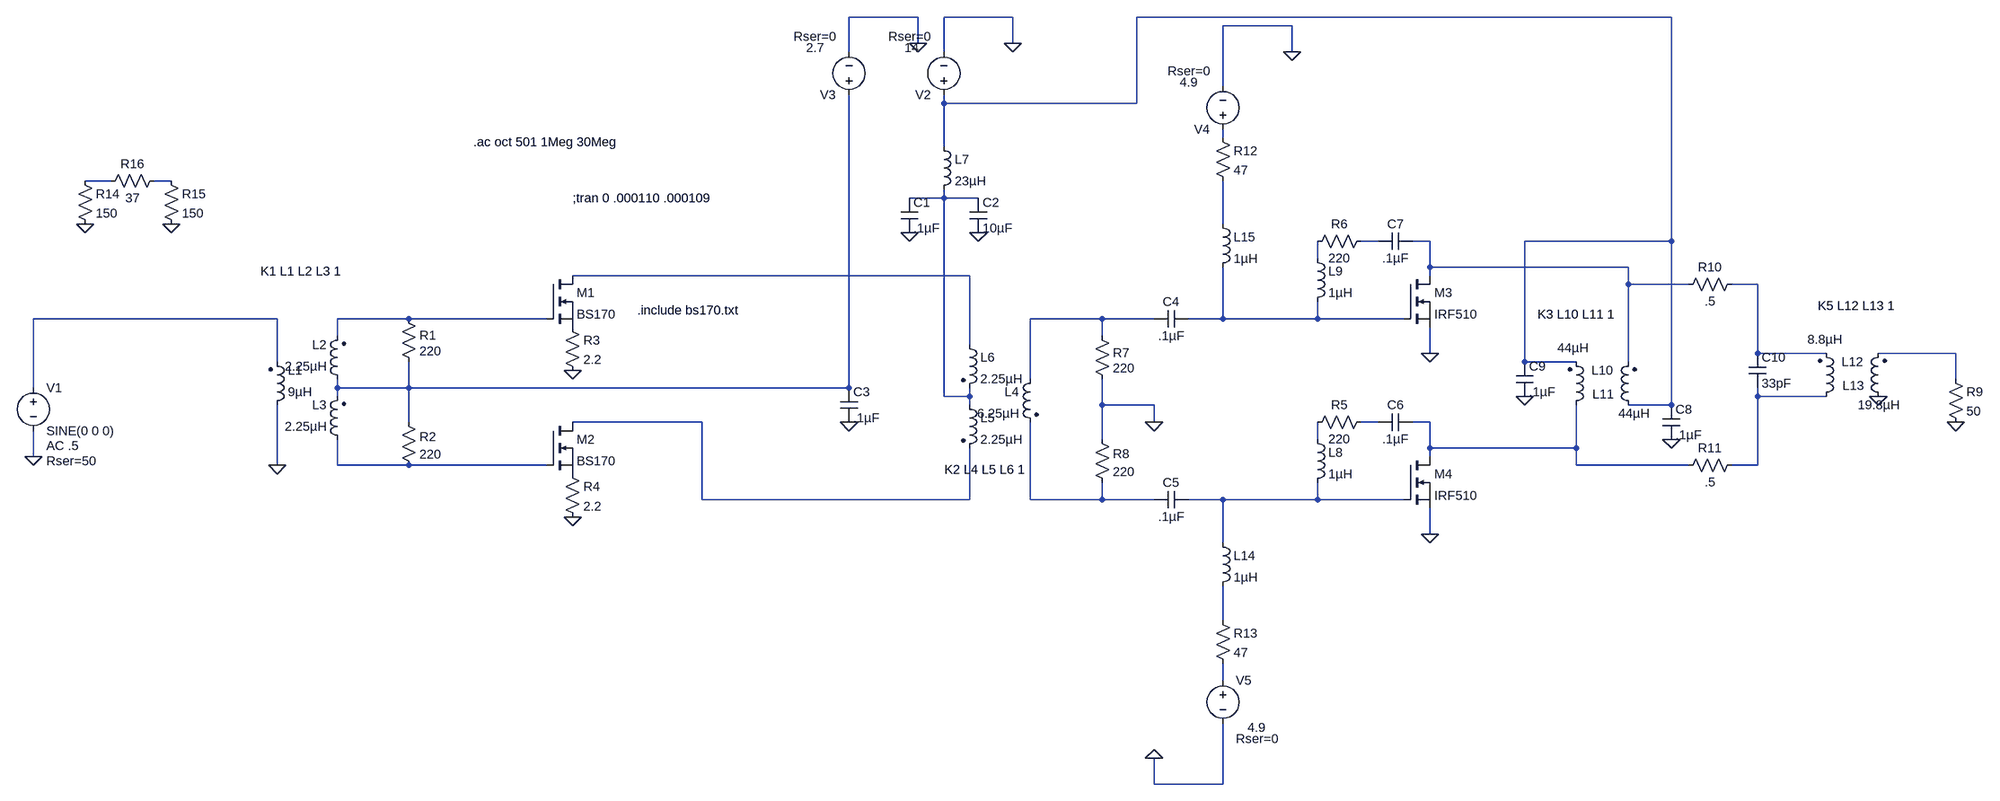
[diagram p0: schematic bs170 push pull.asc]
bs170 push pull.asc, the LTspice schematic file:
Version 4
SHEET 1 2728 900
WIRE 736 -528 608 -528
WIRE 912 -528 784 -528
WIRE 2144 -528 1152 -528
WIRE 1440 -512 1312 -512
WIRE 736 -480 736 -528
WIRE 912 -480 912 -528
WIRE 608 -464 608 -528
WIRE 784 -464 784 -528
WIRE 1440 -464 1440 -512
WIRE 1312 -400 1312 -512
WIRE 784 -368 784 -384
WIRE 1152 -368 1152 -528
WIRE 1152 -368 784 -368
WIRE 1312 -304 1312 -320
WIRE 784 -288 784 -368
WIRE -1040 -224 -1088 -224
WIRE -928 -224 -960 -224
WIRE 784 -192 784 -208
WIRE 784 -192 720 -192
WIRE 848 -192 784 -192
WIRE 1312 -144 1312 -224
WIRE 1600 -112 1568 -112
WIRE 1696 -112 1664 -112
WIRE 2144 -112 2144 -528
WIRE 2144 -112 1872 -112
WIRE 1488 -80 1488 -112
WIRE 1696 -64 1696 -112
WIRE 2064 -64 1696 -64
WIRE 832 -48 80 -48
WIRE 1696 -48 1696 -64
WIRE 2064 -32 2064 -64
WIRE 2176 -32 2064 -32
WIRE 2304 -32 2256 -32
WIRE -480 32 -1184 32
WIRE -224 32 -368 32
WIRE 32 32 -224 32
WIRE 1088 32 944 32
WIRE 1184 32 1088 32
WIRE 1312 32 1312 -64
WIRE 1312 32 1248 32
WIRE 1488 32 1488 0
WIRE 1488 32 1312 32
WIRE 1648 32 1488 32
WIRE -368 64 -368 32
WIRE 1088 64 1088 32
WIRE 832 80 832 -48
WIRE 1696 96 1696 48
WIRE 2304 96 2304 -32
WIRE 2432 96 2304 96
WIRE 2672 96 2528 96
WIRE -480 112 -480 32
WIRE 1872 112 1872 -112
WIRE 1968 112 1872 112
WIRE 2064 112 2064 -32
WIRE 944 144 944 32
WIRE 2672 144 2672 96
WIRE -1184 160 -1184 32
WIRE -368 160 -368 144
WIRE -224 160 -224 112
WIRE -224 160 -368 160
WIRE 608 160 608 -384
WIRE 608 160 -224 160
WIRE -368 176 -368 160
WIRE 784 176 784 -192
WIRE 832 176 832 160
WIRE 832 176 784 176
WIRE 2304 176 2304 160
WIRE 2432 176 2304 176
WIRE 832 192 832 176
WIRE 1088 192 1088 144
WIRE 1184 192 1088 192
WIRE 2144 192 2144 -112
WIRE 2144 192 2064 192
WIRE -224 224 -224 160
WIRE 320 224 80 224
WIRE 1184 224 1184 192
WIRE 1600 224 1568 224
WIRE 1696 224 1664 224
WIRE 1088 256 1088 192
WIRE 1488 256 1488 224
WIRE 1696 272 1696 224
WIRE 1968 272 1968 192
WIRE 1968 272 1696 272
WIRE -1184 288 -1184 240
WIRE 1696 288 1696 272
WIRE -480 304 -480 192
WIRE -368 304 -368 256
WIRE -224 304 -368 304
WIRE 32 304 -224 304
WIRE 1968 304 1968 272
WIRE 2176 304 1968 304
WIRE 2304 304 2304 176
WIRE 2304 304 2256 304
WIRE 320 368 320 224
WIRE 832 368 832 272
WIRE 832 368 320 368
WIRE 944 368 944 224
WIRE 1088 368 1088 336
WIRE 1088 368 944 368
WIRE 1184 368 1088 368
WIRE 1312 368 1248 368
WIRE 1488 368 1488 336
WIRE 1488 368 1312 368
WIRE 1648 368 1488 368
WIRE 1696 432 1696 384
WIRE 1312 448 1312 368
WIRE 1312 592 1312 528
WIRE 1312 704 1312 672
WIRE 1184 896 1184 848
WIRE 1312 896 1312 784
WIRE 1312 896 1184 896
FLAG 80 128 0
FLAG 80 400 0
FLAG -480 304 0
FLAG -1184 288 0
FLAG 1184 224 0
FLAG 912 -480 0
FLAG 736 -480 0
FLAG 720 -128 0
FLAG 848 -128 0
FLAG 608 224 0
FLAG 1440 -464 0
FLAG 2144 256 0
FLAG 1872 176 0
FLAG 2528 176 0
FLAG 2672 224 0
FLAG 1184 848 0
FLAG 1696 96 0
FLAG 1696 432 0
FLAG -1088 -144 0
FLAG -928 -144 0
SYMBOL ind2 -496 208 M180
WINDOW 0 36 80 Left 2
WINDOW 3 36 40 Left 2
SYMATTR InstName L1
SYMATTR Value 9µH
SYMATTR Type ind
SYMBOL ind2 -352 160 R180
WINDOW 0 36 80 Left 2
WINDOW 3 36 40 Left 2
SYMATTR InstName L2
SYMATTR Value 2.25µH
SYMATTR Type ind
SYMBOL ind2 -352 272 R180
WINDOW 0 36 80 Left 2
WINDOW 3 36 40 Left 2
SYMATTR InstName L3
SYMATTR Value 2.25µH
SYMATTR Type ind
SYMBOL res -240 16 R0
WINDOW 0 36 47 Left 2
SYMATTR InstName R1
SYMATTR Value 220
SYMBOL res -240 208 R0
WINDOW 0 36 43 Left 2
SYMATTR InstName R2
SYMATTR Value 220
SYMBOL nmos 32 -48 R0
SYMATTR InstName M1
SYMATTR Value BS170
SYMATTR Prefix X
SYMBOL nmos 32 224 R0
SYMATTR InstName M2
SYMATTR Value BS170
SYMATTR Prefix X
SYMBOL res 64 32 R0
SYMATTR InstName R3
SYMATTR Value 2.2
SYMBOL res 64 304 R0
SYMATTR InstName R4
SYMATTR Value 2.2
SYMBOL ind2 960 128 M0
SYMATTR InstName L4
SYMATTR Value 6.25µH
SYMATTR Type ind
SYMBOL ind2 816 176 R0
SYMATTR InstName L5
SYMATTR Value 2.25µH
SYMATTR Type ind
SYMBOL ind2 816 64 R0
SYMATTR InstName L6
SYMATTR Value 2.25µH
SYMATTR Type ind
SYMBOL voltage -1184 144 R0
WINDOW 123 24 124 Left 2
WINDOW 39 24 152 Left 2
SYMATTR Value2 AC .5
SYMATTR SpiceLine Rser=50
SYMATTR InstName V1
SYMATTR Value SINE(0 0 0)
SYMBOL res 1072 48 R0
WINDOW 0 36 47 Left 2
SYMATTR InstName R7
SYMATTR Value 220
SYMBOL res 1072 240 R0
WINDOW 0 36 43 Left 2
SYMATTR InstName R8
SYMATTR Value 220
SYMBOL voltage 784 -368 R180
WINDOW 123 0 0 Left 0
WINDOW 39 24 124 Left 2
WINDOW 3 46 103 Left 2
SYMATTR SpiceLine Rser=0
SYMATTR Value 14
SYMATTR InstName V2
SYMBOL voltage 608 -368 R180
WINDOW 123 0 0 Left 0
WINDOW 39 24 124 Left 2
WINDOW 3 46 103 Left 2
SYMATTR SpiceLine Rser=0
SYMATTR Value 2.7
SYMATTR InstName V3
SYMBOL ind 768 -304 R0
SYMATTR InstName L7
SYMATTR Value 23µH
SYMBOL cap 704 -192 R0
SYMATTR InstName C1
SYMATTR Value .1µF
SYMBOL cap 832 -192 R0
SYMATTR InstName C2
SYMATTR Value 10µF
SYMBOL cap 592 160 R0
SYMATTR InstName C3
SYMATTR Value .1µF
SYMBOL nmos 1648 -48 R0
SYMATTR InstName M3
SYMATTR Value IRF510
SYMBOL nmos 1648 288 R0
SYMATTR InstName M4
SYMATTR Value IRF510
SYMBOL cap 1248 16 R90
WINDOW 0 0 32 VBottom 2
WINDOW 3 32 32 VTop 2
SYMATTR InstName C4
SYMATTR Value .1µF
SYMBOL cap 1248 352 R90
WINDOW 0 0 32 VBottom 2
WINDOW 3 32 32 VTop 2
SYMATTR InstName C5
SYMATTR Value .1µF
SYMBOL cap 1664 208 R90
WINDOW 0 0 32 VBottom 2
WINDOW 3 32 32 VTop 2
SYMATTR InstName C6
SYMATTR Value .1µF
SYMBOL res 1584 208 R90
WINDOW 0 0 56 VBottom 2
WINDOW 3 32 56 VTop 2
SYMATTR InstName R5
SYMATTR Value 220
SYMBOL ind 1472 240 R0
SYMATTR InstName L8
SYMATTR Value 1µH
SYMBOL cap 1664 -128 R90
WINDOW 0 0 32 VBottom 2
WINDOW 3 32 32 VTop 2
SYMATTR InstName C7
SYMATTR Value .1µF
SYMBOL res 1584 -128 R90
WINDOW 0 0 56 VBottom 2
WINDOW 3 32 56 VTop 2
SYMATTR InstName R6
SYMATTR Value 220
SYMBOL ind 1472 -96 R0
SYMATTR InstName L9
SYMATTR Value 1µH
SYMBOL voltage 1312 -304 R180
WINDOW 123 0 0 Left 0
WINDOW 39 24 124 Left 2
WINDOW 3 46 103 Left 2
SYMATTR SpiceLine Rser=0
SYMATTR Value 4.9
SYMATTR InstName V4
SYMBOL ind2 1952 208 M180
WINDOW 0 44 80 Left 2
WINDOW 3 -19 122 Left 2
SYMATTR InstName L10
SYMATTR Value 44µH
SYMATTR Type ind
SYMBOL ind2 2080 208 R180
WINDOW 0 42 36 Left 2
WINDOW 3 -24 0 Left 2
SYMATTR InstName L11
SYMATTR Value 44µH
SYMATTR Type ind
SYMBOL cap 2128 192 R0
SYMATTR InstName C8
SYMATTR Value .1µF
SYMBOL cap 1856 112 R0
SYMATTR InstName C9
SYMATTR Value .1µF
SYMBOL cap 2288 96 R0
SYMATTR InstName C10
SYMATTR Value 33pF
SYMBOL ind2 2416 192 M180
WINDOW 0 44 80 Left 2
WINDOW 3 -19 122 Left 2
SYMATTR InstName L12
SYMATTR Value 8.8µH
SYMATTR Type ind
SYMBOL ind2 2544 192 R180
WINDOW 0 42 36 Left 2
WINDOW 3 -24 0 Left 2
SYMATTR InstName L13
SYMATTR Value 19.8µH
SYMATTR Type ind
SYMBOL res 2656 128 R0
SYMATTR InstName R9
SYMATTR Value 50
SYMBOL voltage 1312 688 R0
WINDOW 123 0 0 Left 0
WINDOW 39 24 124 Left 2
WINDOW 3 46 103 Left 2
SYMATTR SpiceLine Rser=0
SYMATTR Value 4.9
SYMATTR InstName V5
SYMBOL ind 1296 432 R0
SYMATTR InstName L14
SYMATTR Value 1µH
SYMBOL ind 1296 -160 R0
SYMATTR InstName L15
SYMATTR Value 1µH
SYMBOL res 2272 -48 R90
WINDOW 0 0 56 VBottom 2
WINDOW 3 32 56 VTop 2
SYMATTR InstName R10
SYMATTR Value .5
SYMBOL res 2272 288 R90
WINDOW 0 0 56 VBottom 2
WINDOW 3 32 56 VTop 2
SYMATTR InstName R11
SYMATTR Value .5
SYMBOL res 1296 -320 R0
SYMATTR InstName R12
SYMATTR Value 47
SYMBOL res 1296 576 R0
SYMATTR InstName R13
SYMATTR Value 47
SYMBOL res -1104 -240 R0
SYMATTR InstName R14
SYMATTR Value 150
SYMBOL res -944 -240 R0
SYMATTR InstName R15
SYMATTR Value 150
SYMBOL res -944 -240 R90
WINDOW 0 0 56 VBottom 2
WINDOW 3 32 56 VTop 2
SYMATTR InstName R16
SYMATTR Value 37
TEXT 936 312 Right 2 !K2 L4 L5 L6 1
TEXT 200 16 Left 2 !.include bs170.txt
TEXT -360 -56 Right 2 !K1 L1 L2 L3 1
TEXT 80 -192 Left 2 !;tran 0 .000110 .000109
TEXT 2040 24 Right 2 !K3 L10 L11 1
TEXT 2560 8 Right 2 !K5 L12 L13 1
TEXT -104 -296 Left 2 !.ac oct 501 1Meg 30Meg

The netlist it stands for:
* bs170 push pull.asc
L1 0 N012 9µH
L2 N017 N013 2.25µH
L3 N023 N017 2.25µH
R1 N013 N017 220
R2 N017 N023 220
XM1 N010 N013 P001 BS170  ; pins D G S
XM2 N019 N023 P002 BS170  ; pins D G S
R3 P001 0 2.2
R4 P002 0 2.2
L4 N014 N024 6.25µH
L5 N005 N019 2.25µH
L6 N010 N005 2.25µH
V1 N012 0 SINE(0 0 0) AC .5 Rser=50
R7 N014 0 220
R8 0 N024 220
V2 N001 0 14 Rser=0
V3 N017 0 2.7 Rser=0
L7 N001 N005 23µH
C1 N005 0 .1µF
C2 N005 0 10µF
C3 N017 0 .1µF
M3 N008 N015 0 0 IRF510
M4 N021 N025 0 0 IRF510
C4 N015 N014 .1µF
C5 N025 N024 .1µF
C6 N021 N020 .1µF
R5 N020 N022 220
L8 N022 N025 1µH
C7 N008 N007 .1µF
R6 N007 N009 220
L9 N009 N015 1µH
V4 N002 0 4.9 Rser=0
L10 N021 N001 44µH
L11 N001 N008 44µH
C8 N001 0 .1µF
C9 N001 0 .1µF
C10 N011 N018 33pF
L12 N018 N011 8.8µH
L13 0 N016 19.8µH
R9 N016 0 50
V5 N027 0 4.9 Rser=0
L14 N025 N026 1µH
L15 N006 N015 1µH
R10 N011 N008 .5
R11 N018 N021 .5
R12 N002 N006 47
R13 N026 N027 47
R14 N003 0 150
R15 N004 0 150
R16 N004 N003 37
.model NMOS NMOS
.model PMOS PMOS
.lib standard.mos
K2 L4 L5 L6 1
.include bs170.txt
K1 L1 L2 L3 1
;tran 0 .000110 .000109
K3 L10 L11 1
K5 L12 L13 1
.ac oct 501 1Meg 30Meg
.backanno
.end